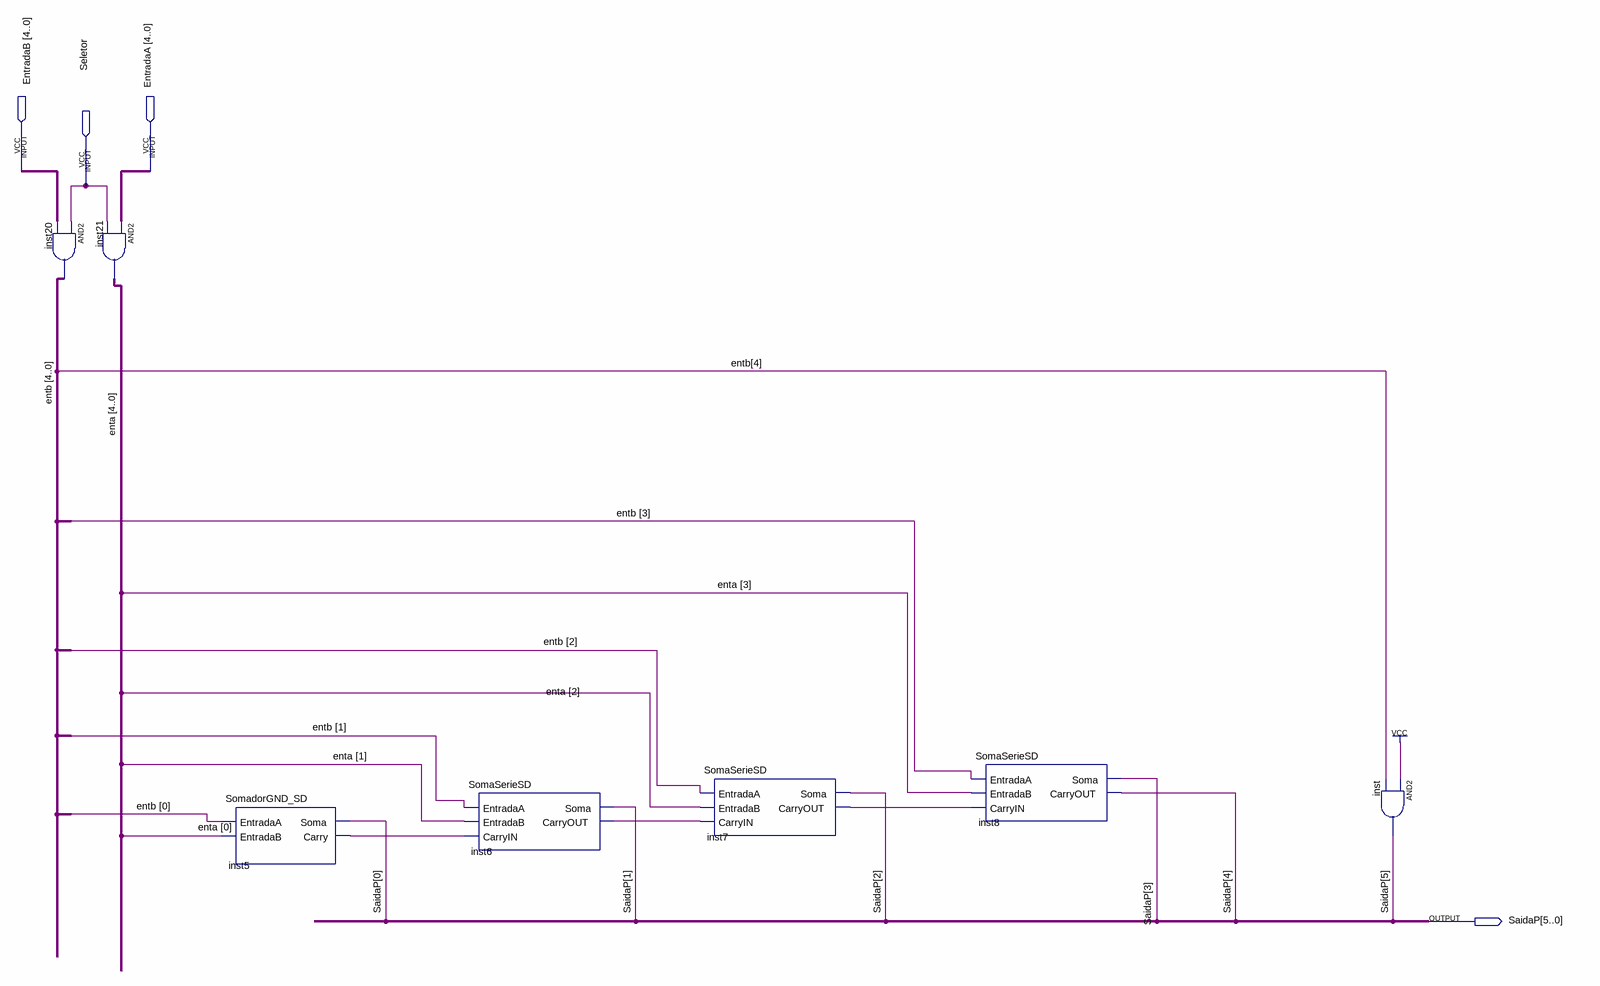
[diagram p0: schematic sheet]
// Quartus schematic CircuitoSomador.bdf as structural Verilog: 7 symbols, 4 pins
module CircuitoSomador (
  input  [4:0] EntradaB,
  input  [4:0] EntradaA,
  input  Seletor,
  output [5:0] SaidaP
);

  wire inst5_carry, inst6_carryout, inst7_carryout;
  wire [4:0] enta, entb;

  assign entb = {5{Seletor}} & EntradaB;  // AND2 inst20, 5 bits wide
  assign enta = EntradaA & {5{Seletor}};  // AND2 inst21, 5 bits wide
  SomadorGND_SD inst5 (.EntradaA(entb[0]), .EntradaB(enta[0]), .Soma(SaidaP[0]), .Carry(inst5_carry));
  SomaSerieSD inst6 (
    .EntradaA(entb[1]), .EntradaB(enta[1]), .CarryIN(inst5_carry), .Soma(SaidaP[1]), .CarryOUT(inst6_carryout));
  SomaSerieSD inst7 (
    .EntradaA(entb[2]), .EntradaB(enta[2]), .CarryIN(inst6_carryout), .Soma(SaidaP[2]),
    .CarryOUT(inst7_carryout));
  SomaSerieSD inst8 (
    .EntradaA(entb[3]), .EntradaB(enta[3]), .CarryIN(inst7_carryout), .Soma(SaidaP[3]), .CarryOUT(SaidaP[4]));
  and inst (SaidaP[5], 1'b1, entb[4]);
endmodule
